# EAGLE design Schematic 1 (EAGLE 9.6.2)
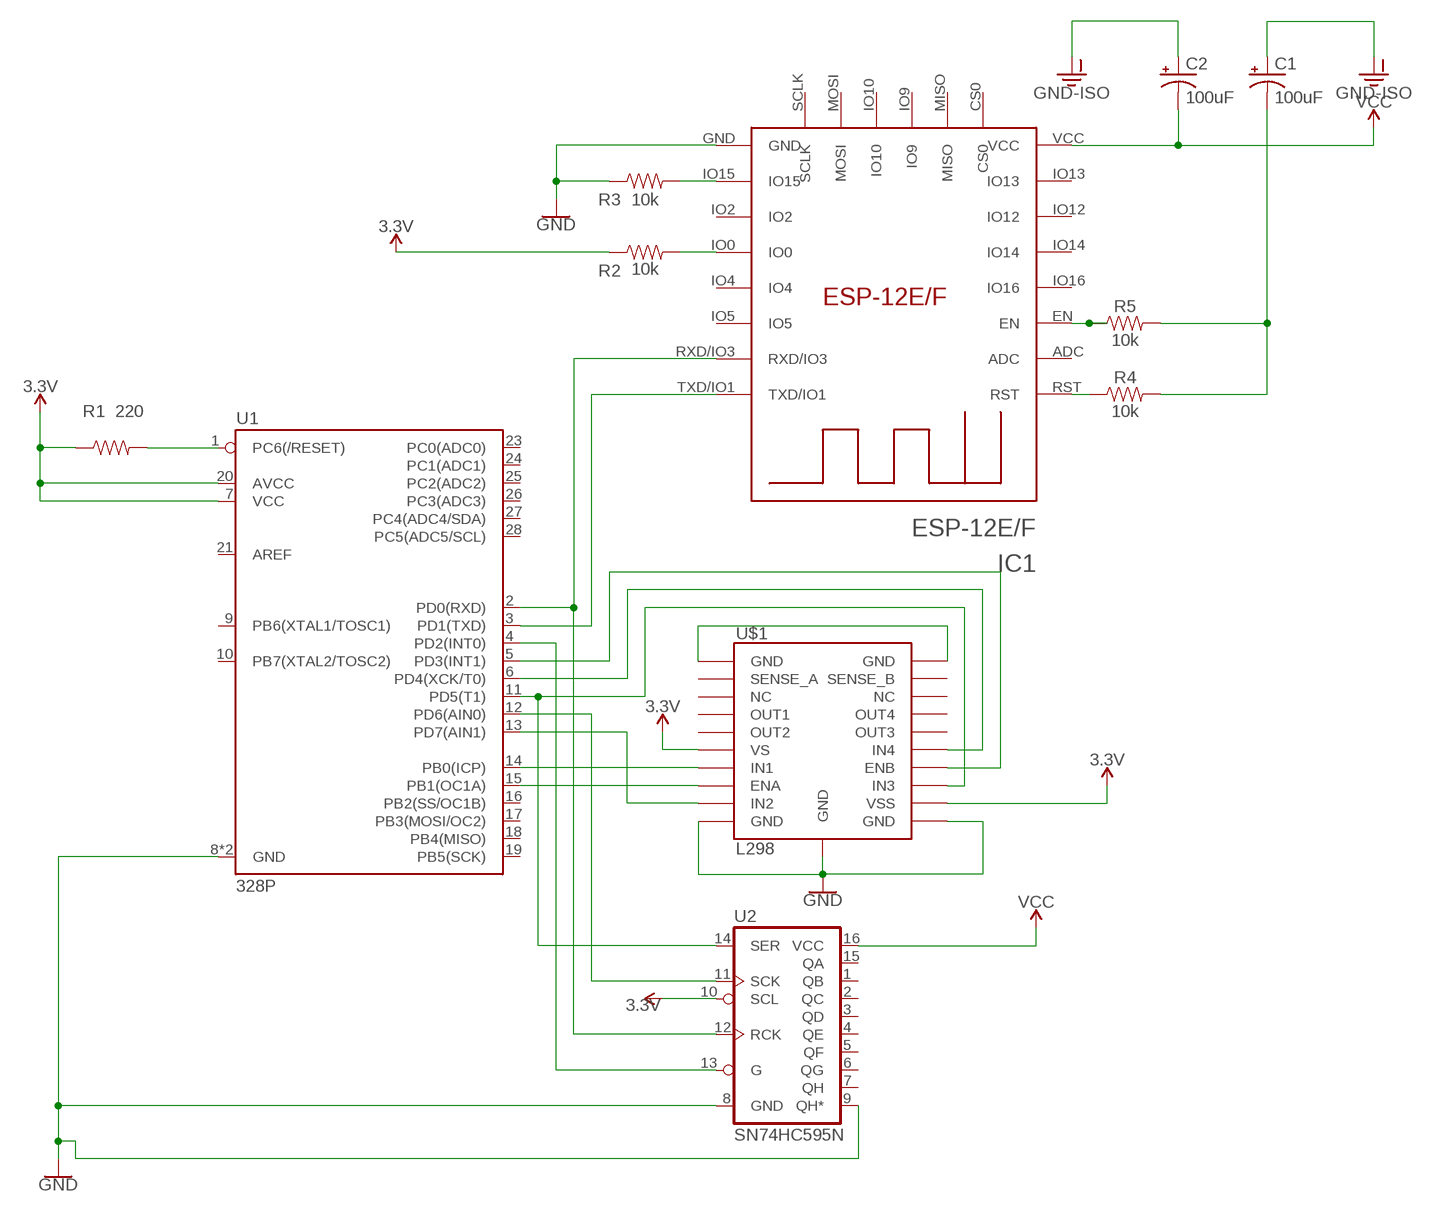
[diagram p0: schematic, sheet 1]

## Parts
C1  100uF  100UF-POLAR-RADIAL-2.5MM-25V-20%  [CPOL-RADIAL-2.5MM-6.5MM]
C2  100uF  100UF-POLAR-RADIAL-2.5MM-25V-20%  [CPOL-RADIAL-2.5MM-6.5MM]
IC1  ESP-12E/F  [ESP-12E]
R1  220  220OHM-0603-1/10W-1%  [0603]
R2  10k  10KOHM-HORIZ-1/4W-1%  [AXIAL-0.3]
R3  10k  10KOHM-HORIZ-1/4W-1%  [AXIAL-0.3]
R4  10k  10KOHM-HORIZ-1/4W-1%  [AXIAL-0.3]
R5  10k  10KOHM-HORIZ-1/4W-1%  [AXIAL-0.3]
U1  328P  ATMEGA328P_PDIP  [DIP28]
U2  SN74HC595N  74HC595N  [DIP16]
U$1  L298  L298_SMD_W_PAD  [POWERSO20_L298_PAD]

## Nets
3.3V: R1.1 R2.P$1 U1.7(VCC) U1.20(AVCC) U2.10(SCL) U$1.6(VS) U$1.12(VSS)
GND: IC1.GND R3.P$1 U1.8(GND) U1.22(GND) U2.8(GND) U2.9(QH*) U$1.10(GND) U$1.11(GND) U$1.PAD(GND)
GND-ISO: C1.1(+) C2.1(+)
N$1: R1.2 U1.1(PC6(/RESET))
N$2: U1.13(PD7(AIN1)) U$1.9(IN2)
N$3: IC1.TXD/IO1 U1.3(PD1(TXD))
N$4: U1.5(PD3(INT1)) U$1.14(ENB)
N$5: U1.11(PD5(T1)) U2.14(SER) U$1.13(IN3)
N$6: U$1.1(GND) U$1.20(GND)
N$7: U1.14(PB0(ICP)) U$1.7(IN1)
N$8: U1.15(PB1(OC1A)) U$1.8(ENA)
N$9: U1.4(PD2(INT0)) U2.13(G)
N$10: U1.6(PD4(XCK/T0)) U$1.15(IN4)
N$11: IC1.RXD/IO3 U1.2(PD0(RXD)) U2.12(RCK)
N$12: U1.12(PD6(AIN0)) U2.11(SCK)
N$13: IC1.IO0 R2.P$2
N$14: IC1.IO15 R3.P$2
N$15: C1.2(-) R4.P$2 R5.P$2
N$16: IC1.EN R5.P$1
N$19: IC1.RST R4.P$1
VCC: C2.2(-) IC1.VCC U2.16(VCC)
Unconnected: IC1.ADC IC1.CS0 IC1.IO2 IC1.IO4 IC1.IO5 IC1.IO9 IC1.IO10 IC1.IO12 IC1.IO13 IC1.IO14 IC1.IO16 IC1.MISO IC1.MOSI IC1.SCLK U1.9(PB6(XTAL1/TOSC1)) U1.10(PB7(XTAL2/TOSC2)) U1.16(PB2(SS/OC1B)) U1.17(PB3(MOSI/OC2)) U1.18(PB4(MISO)) U1.19(PB5(SCK)) U1.21(AREF) U1.23(PC0(ADC0)) U1.24(PC1(ADC1)) U1.25(PC2(ADC2)) U1.26(PC3(ADC3)) U1.27(PC4(ADC4/SDA)) U1.28(PC5(ADC5/SCL)) U2.1(QB) U2.2(QC) U2.3(QD) U2.4(QE) U2.5(QF) U2.6(QG) U2.7(QH) U2.15(QA) U$1.2(SENSE_A) U$1.3(NC) U$1.4(OUT1) U$1.5(OUT2) U$1.16(OUT3) U$1.17(OUT4) U$1.18(NC) U$1.19(SENSE_B)

## Library data of the parts
C1 C2 = SparkFun-Capacitors:100UF-POLAR: 100µF polarized capacitors A capacitor is a passive two-terminal electrical component used to store electrical energy temporarily in an electric field.; PROD_ID: CAP-08439
IC1 = esp-12e-f:ESP-12E/F
R1 = SparkFun-Resistors:220OHM: 220Ω resistor A resistor is a passive two-terminal electrical component that implements electrical resistance as a circuit element. Resistors act to reduce current flow, and, at the same time, act to lower voltage levels within circuits. - Wikipedia; PROD_ID: RES-07861
R2-R5 = SparkFun-Resistors:10KOHM: 10kΩ resistor A resistor is a passive two-terminal electrical component that implements electrical resistance as a circuit element. Resistors act to reduce current flow, and, at the same time, act to lower voltage levels within circuits. - Wikipedia; PROD_ID: RES-12183
U1 = SparkFun-IC-Microcontroller:ATMEGA328P_PDIP: Atmel 328P Through hole ATMEGA328P uC used in the Arduino 32kb flash, 1k EEPROM, 2k SRAM Datasheet <http://www.sparkfun.com/datasheets/Components/SMD/ATMega328.pdf> SparkFun Products Storefront component: AVR 28 Pin 20MHz 32K 6A/D - ATMega328P <https://www.sparkfun.com/products/9061> (COM-09061) SparkFun Simon Says - Through-Hole Soldering Kit <https://www.sparkfun.com/products/10547> (KIT-10547) SparkFun Learn to Solder - Simon Says <https://www.sparkfun.com/products/13708> (KIT-13708) SparkFun BigTime Watch Kit <https://www.sparkfun.com/products/11734> (KIT-11734) SparkFun ClockIt <https://www.sparkfun.com/products/10930> (KIT-10930) SparkFun Serial Enabled LCD Kit <https://www.sparkfun.com/products/10097> (LCD-10097) SparkFun Simon Tilts - Through Hole Soldering Kit <https://www.sparkfun.com/products/12634> (KIT-12634) SparkFun Frequency Counter Kit <https://www.sparkfun.com/products/10140> (KIT-10140) FabFM Radio Kit <https://www.sparkfun.com/products/11043> (KIT-11043) SparkFun Binary Blaster Kit <https://www.sparkfun.com/products/12037> (KIT-12037) SparkFun Metro-Gnome <https://www.sparkfun.com/products/9236> (KIT-09236) ATmega328 with Arduino Optiboot (Uno) <https://www.sparkfun.com/products/10524> (DEV-10524); PROD_ID: IC-09136
U2 = SparkFun-IC-Logic:74*595: 8-Bit Shift Register (Serial to Parallel) Datasheet <http://cdn.sparkfun.com/datasheets/BreakoutBoards/MM74HC595.pdf> SparkFun Products SparkFun Shift Register Breakout - 74HC595 <https://www.sparkfun.com/products/10680> (BOB-10680); PROD_ID: IC-13123
U$1 = SparkFun-IC-Special-Function:L298_SMD_W_PAD: Full-bridge power driver IC This device uses the ground pad under the IC; PROD_ID: IC-09133

## Board
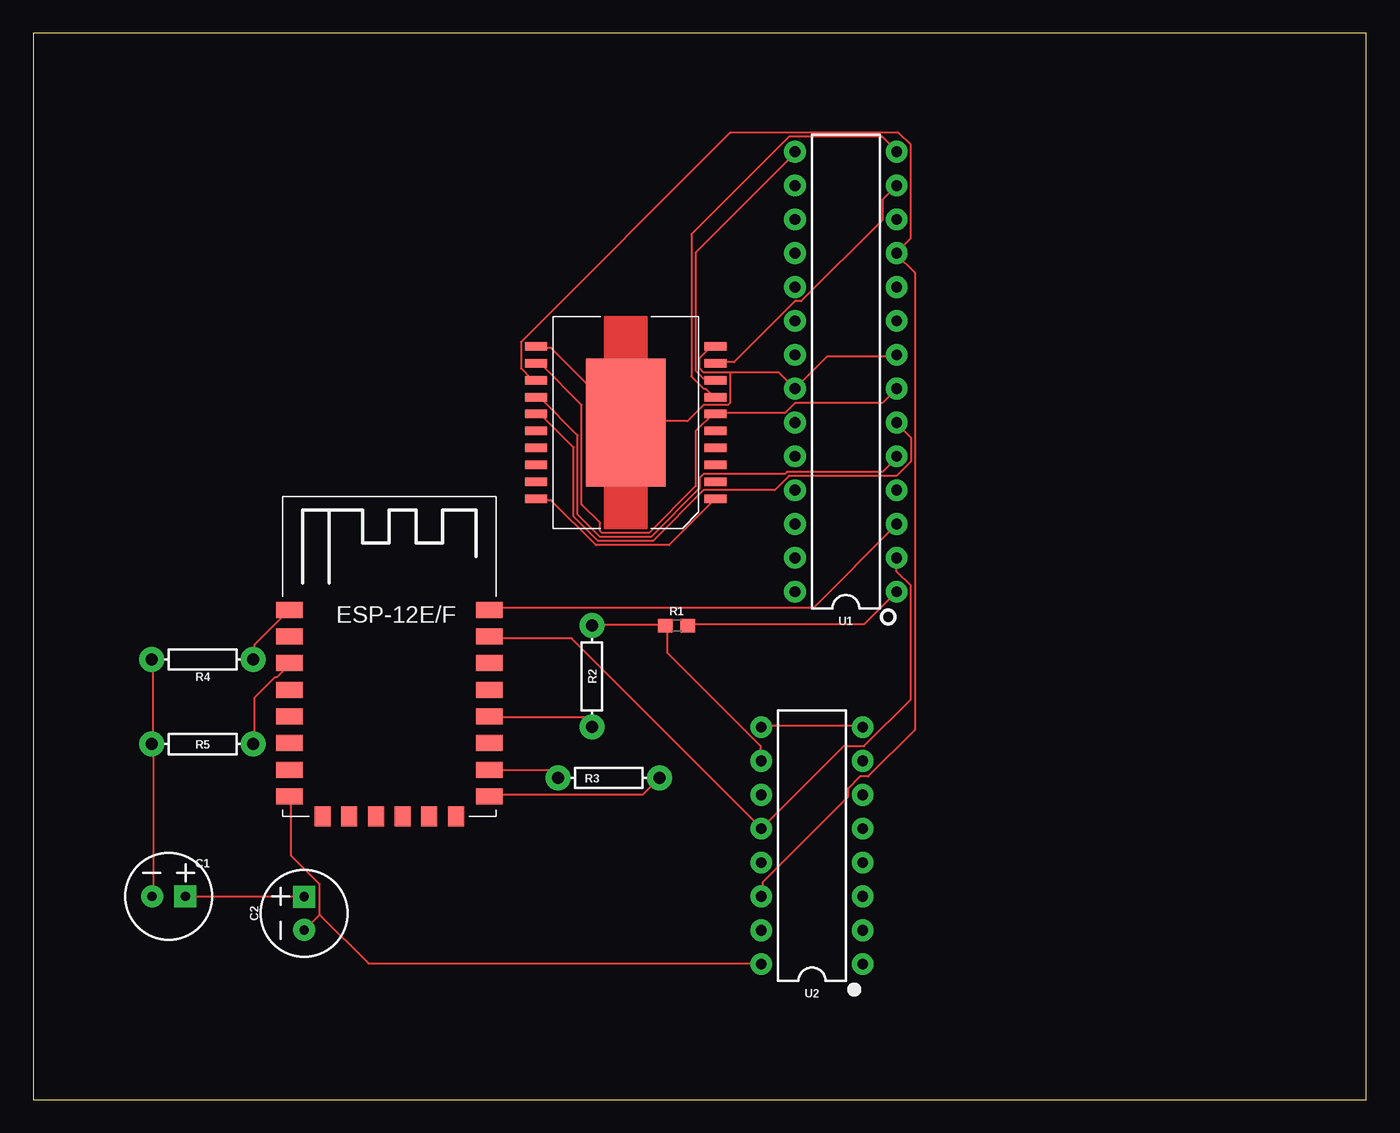
[diagram p1: board, top side]
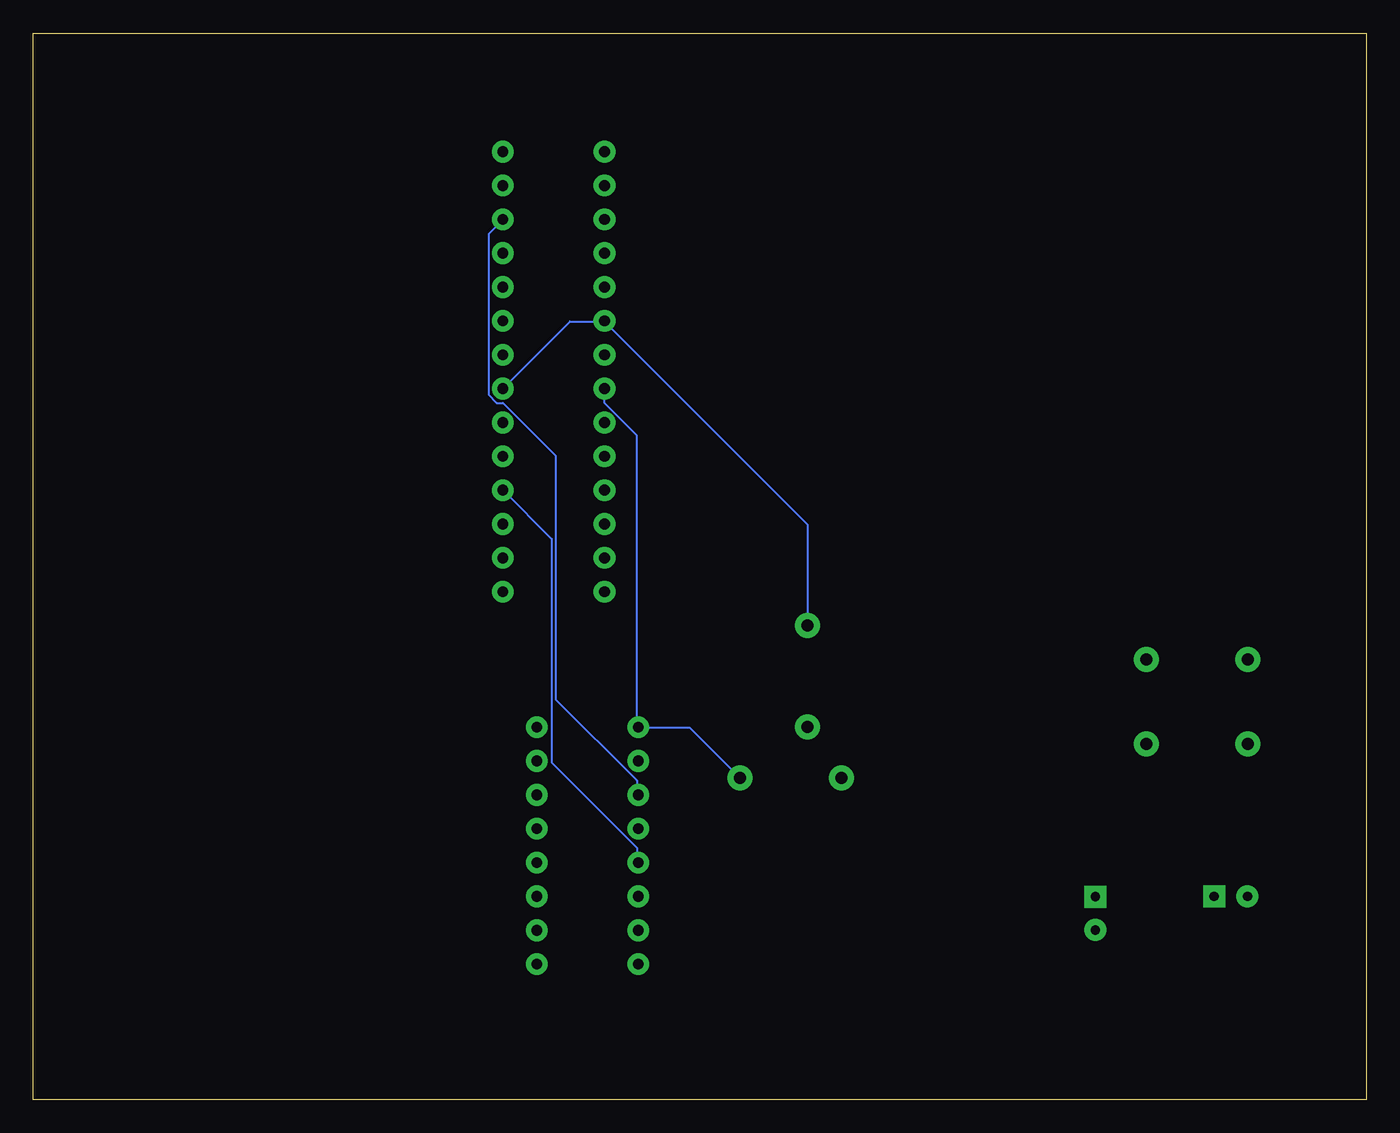
[diagram p2: board, bottom side, seen from below]

Size 100 x 80 mm. Coordinates in mm from the lower left corner, seen from the top.
Outline: 0,0 100,0 100,80 0,80 0,0
Copper layers (1*16): Top 0.035mm / dielectric 1.5mm / Bottom 0.035mm
Design rules "default": minimum track width 6mil, minimum drill 0.35mm, track to track 6mil, track to pad 6mil, pad to pad 6mil, via to via 6mil, smd to smd 6mil, copper to edge 40mil, drill to drill 6mil, minimum pad ring 10mil, minimum via ring 8mil, stop-mask expansion 4mil, vias tented up to drill 0mil, thermal gap 10mil

### Footprints (pad centres in the part's own frame; a part is rotated, then mirrored left to right if it is on the bottom)
CPOL-RADIAL-2.5MM-6.5MM = drill 0.7 pad 1.651 square: 1 1.25,0 | drill 0.7 pad 1.651: 2 -1.25,0
ESP-12E = smd 2 x 1.2: ADC -7.46,5.53; EN -7.46,3.53; GND 7.54,-6.47; IO0 7.54,-0.47; IO2 7.54,-2.47; IO4 7.54,1.53; IO5 7.54,3.53; IO12 -7.46,-2.47; IO13 -7.46,-4.47; IO14 -7.46,-0.47; IO15 7.54,-4.47; IO16 -7.46,1.53; RST -7.46,7.53; RXD/IO3 7.54,5.53; TXD/IO1 7.54,7.53; VCC -7.46,-6.47 | smd 1.2 x 1.5: CS0 -4.96,-7.97; IO9 -0.96,-7.97; IO10 1.04,-7.97; MISO -2.96,-7.97; MOSI 3.04,-7.97; SCLK 5.04,-7.97
0603 = smd 1.1 x 1: 1 -0.85,0; 2 0.85,0
AXIAL-0.3 = drill 0.9 pad 1.88: P$1 -3.81,0; P$2 3.81,0
DIP28 = drill 0.813 pad 1.626: 1 -16.51,-3.81; 2 -13.97,-3.81; 3 -11.43,-3.81; 4 -8.89,-3.81; 5 -6.35,-3.81; 6 -3.81,-3.81; 7 -1.27,-3.81; 8 1.27,-3.81; 9 3.81,-3.81; 10 6.35,-3.81; 11 8.89,-3.81; 12 11.43,-3.81; 13 13.97,-3.81; 14 16.51,-3.81; 15 16.51,3.81; 16 13.97,3.81; 17 11.43,3.81; 18 8.89,3.81; 19 6.35,3.81; 20 3.81,3.81; 21 1.27,3.81; 22 -1.27,3.81; 23 -3.81,3.81; 24 -6.35,3.81; 25 -8.89,3.81; 26 -11.43,3.81; 27 -13.97,3.81; 28 -16.51,3.81
DIP16 = drill 0.813 pad 1.626: 1 -8.89,-3.81; 2 -6.35,-3.81; 3 -3.81,-3.81; 4 -1.27,-3.81; 5 1.27,-3.81; 6 3.81,-3.81; 7 6.35,-3.81; 8 8.89,-3.81; 9 8.89,3.81; 10 6.35,3.81; 11 3.81,3.81; 12 1.27,3.81; 13 -1.27,3.81; 14 -3.81,3.81; 15 -6.35,3.81; 16 -8.89,3.81
POWERSO20_L298_PAD = smd 1.651 x 0.635: 1 -6.731,5.715; 2 -6.731,4.445; 3 -6.731,3.175; 4 -6.731,1.905; 5 -6.731,0.635; 6 -6.731,-0.635; 7 -6.731,-1.905; 8 -6.731,-3.175; 9 -6.731,-4.445; 10 -6.731,-5.715; 11 6.731,-5.715; 12 6.731,-4.445; 13 6.731,-3.175; 14 6.731,-1.905; 15 6.731,-0.635; 16 6.731,0.635; 17 6.731,1.905; 18 6.731,3.175; 19 6.731,4.445; 20 6.731,5.715 | smd 5.994 x 9.601: PAD 0,0

### Placement (x,y rotation side)
C1  10.16,15.24 0 top
C2  20.32,13.97 90 top
IC1  26.67,29.21 0 top
R1  48.26,35.56 0 top
R2  41.91,31.75 270 top
R3  43.18,24.13 180 top
R4  12.7,33.02 180 top
R5  12.7,26.67 180 top
U1  60.96,54.61 90 top
U2  58.42,19.05 90 top
U$1  44.45,50.8 180 top

### Tracks (layer width: path | path; a pad name or v marks a point on that pad's centre or on a via)
3.3V
  Top 0.152: R2.P$1 41.91,35.66 47.4,35.66 R1.1 47.55,35.51 47.55,33.53 54.56,26.52 54.56,25.45 U2.10 | U1.7 63.7,52.27 57.15,52.27 56.39,51.51 51.21,51.51 U$1.6 51.05,51.51 49.68,50.14 49.68,46.02 46.18,42.52 42.67,42.52 42.52,42.67 42.52,43.28 41.15,44.65 41.15,52.12 38.1,55.17 37.8,55.17 U$1.12
  Bottom 0.152: 57.15,58.37 59.74,58.37 U1.7 | R2.P$1 41.91,43.13 57.15,58.37 | 57.15,58.37 U1.20
GND
  Top 0.152: U$1.11 37.8,56.39 38.86,56.39 U$1.PAD 44.5,50.9 49.07,50.9 50.29,52.12 52.12,52.12 52.27,52.27 52.27,54.56 | 52.27,54.56 55.93,54.56 U1.22 59.59,55.78 64.77,55.78 U1.8 | 52.27,54.56 50.29,54.56 49.99,54.86 49.99,55.63 50.75,56.39 51.05,56.39 U$1.10 | U2.9 54.71,28.04 62.18,28.04 U2.8 | R3.P$1 45.72,22.86 34.29,22.86 IC1.GND
  Bottom 0.152: R3.P$1 50.75,27.89 54.56,27.89 U2.9 54.71,28.04 54.71,49.84 57.15,52.27 U1.22
GND-ISO
  Top 0.152: C1.1 20.27,15.24 C2.1
N$1
  Top 0.152: U1.1 62.33,35.66 49.23,35.66 R1.2
N$2
  Top 0.152: U1.13 63.7,67.51 63.7,65.99 57.61,59.89 57.15,59.89 52.58,55.32 51.21,55.32 U$1.9
N$3
  Top 0.152: IC1.TXD/IO1 34.29,36.88 58.52,36.88 64.77,43.13 U1.3
N$4
  Top 0.152: U$1.14 37.8,52.58 38.1,52.58 40.84,49.84 40.84,43.89 42.52,42.22 46.33,42.22 49.99,45.87 49.99,46.63 50.29,46.94 56.39,46.94 56.54,47.09 63.7,47.09 64.77,48.16 U1.5
N$5
  Top 0.152: U$1.13 37.64,54.1 37.34,54.1 36.58,54.86 36.58,56.84 52.27,72.54 64.92,72.54 65.84,71.63 65.84,64.62 64.77,63.55 U1.11 64.77,63.4 66.14,62.03 66.14,27.74 62.64,24.23 62.03,24.23 61.11,23.32 61.11,22.71 54.71,16.31 54.71,15.24 U2.14
N$6
  Top 0.152: U$1.1 47.7,41.6 42.22,41.6 38.86,44.96 37.8,44.96 U$1.20
N$7
  Top 0.152: U$1.7 51.05,52.73 50.44,53.34 50.29,53.34 49.38,54.25 49.38,64.92 56.69,72.24 63.7,72.24 64.77,71.17 U1.14
N$8
  Top 0.152: U$1.8 51.05,54.1 50.29,54.1 49.68,54.71 49.68,63.55 57.15,71.02 U1.15
N$9
  Bottom 0.152: U1.4 61.11,42.06 61.11,25.3 54.71,18.9 54.71,17.83 U2.13
N$10
  Top 0.152: U$1.15 37.8,51.36 38.1,51.36 40.54,48.92 40.54,43.74 42.37,41.91 46.48,41.91 50.29,45.72 55.63,45.72 56.69,46.79 64.77,46.79 65.84,47.85 65.84,49.68 64.77,50.75 U1.6
N$11
  Top 0.152: IC1.RXD/IO3 34.29,34.59 40.39,34.59 54.56,20.42 U2.12 60.81,26.52 62.33,26.52 65.84,30.02 65.84,38.56 64.77,39.62 U1.2
N$12
  Bottom 0.152: U2.11 54.71,22.86 54.71,23.93 60.81,30.02 60.81,48.31 64.77,52.27 65.23,52.27 65.84,52.88 65.84,64.92 64.77,65.99 U1.12
N$13
  Top 0.152: IC1.IO0 34.29,28.65 41.3,28.65 41.91,28.04 R2.P$2
N$14
  Top 0.152: IC1.IO15 34.29,24.69 38.86,24.69 39.32,24.23 R3.P$2
N$15
  Top 0.152: 8.99,26.67 8.99,15.24 C1.2 | 8.99,26.67 8.99,32.92 R4.P$2 | 8.99,26.67 R5.P$2
N$16
  Top 0.152: IC1.EN 19.2,32.61 18.29,31.7 18.14,31.7 16.61,30.18 16.61,26.67 R5.P$1
N$19
  Top 0.152: IC1.RST 19.2,36.73 16.61,34.14 16.61,33.07 R4.P$1
VCC
  Top 0.152: 21.49,13.87 21.49,16.15 19.36,18.29 19.36,22.71 IC1.VCC | 21.49,13.87 20.42,12.8 C2.2 | 21.49,13.87 25.15,10.21 54.56,10.21 U2.16